# EAGLE schematic Layout (EAGLE 6.2)
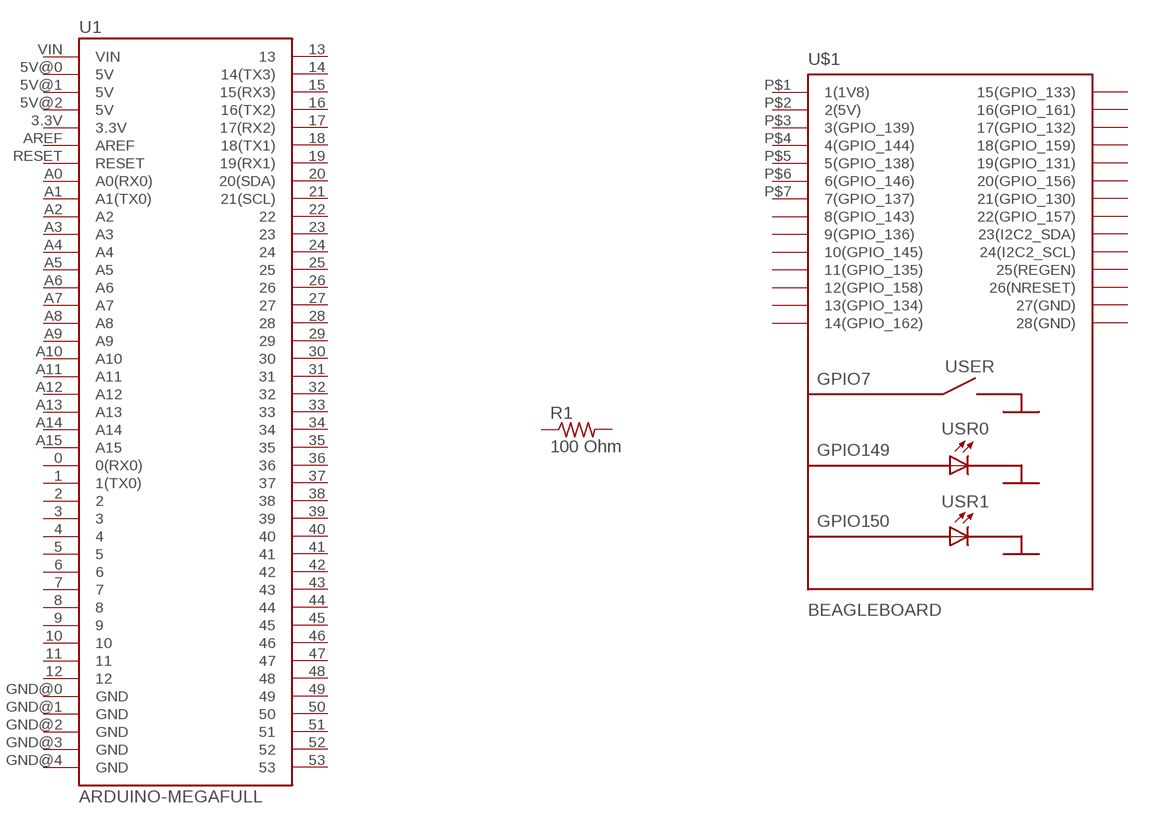
[diagram p0: schematic, sheet 1]

## Parts
R1  100 Ohm  R-US_0204/2V  [0204V]
U1  ARDUINO-MEGAFULL  [ARDUINO_MEGA]
U$1  BEAGLEBOARD  [BEAGLEBOARD]
Unconnected: R1.1 R1.2 U1.0(0(RX0)) U1.1(1(TX0)) U1.2 U1.3 U1.3.3V U1.4 U1.5 U1.5V@0(5V) U1.5V@1(5V) U1.5V@2(5V) U1.6 U1.7 U1.8 U1.9 U1.10 U1.11 U1.12 U1.13 U1.14(14(TX3)) U1.15(15(RX3)) U1.16(16(TX2)) U1.17(17(RX2)) U1.18(18(TX1)) U1.19(19(RX1)) U1.20(20(SDA)) U1.21(21(SCL)) U1.22 U1.23 U1.24 U1.25 U1.26 U1.27 U1.28 U1.29 U1.30 U1.31 U1.32 U1.33 U1.34 U1.35 U1.36 U1.37 U1.38 U1.39 U1.40 U1.41 U1.42 U1.43 U1.44 U1.45 U1.46 U1.47 U1.48 U1.49 U1.50 U1.51 U1.52 U1.53 U1.A0(A0(RX0)) U1.A1(A1(TX0)) U1.A2 U1.A3 U1.A4 U1.A5 U1.A6 U1.A7 U1.A8 U1.A9 U1.A10 U1.A11 U1.A12 U1.A13 U1.A14 U1.A15 U1.AREF U1.GND@0(GND) U1.GND@1(GND) U1.GND@2(GND) U1.GND@3(GND) U1.GND@4(GND) U1.RESET U1.VIN U$1.P$1(1(1V8)) U$1.P$2(2(5V)) U$1.P$3(3(GPIO_139)) U$1.P$4(4(GPIO_144)) U$1.P$5(5(GPIO_138)) U$1.P$6(6(GPIO_146)) U$1.P$7(7(GPIO_137)) U$1.P$8(8(GPIO_143)) U$1.P$9(9(GPIO_136)) U$1.P$10(10(GPIO_145)) U$1.P$11(11(GPIO_135)) U$1.P$12(12(GPIO_158)) U$1.P$13(13(GPIO_134)) U$1.P$14(14(GPIO_162)) U$1.P$15(15(GPIO_133)) U$1.P$16(16(GPIO_161)) U$1.P$17(17(GPIO_132)) U$1.P$18(18(GPIO_159)) U$1.P$19(19(GPIO_131)) U$1.P$20(20(GPIO_156)) U$1.P$21(21(GPIO_130)) U$1.P$22(22(GPIO_157)) U$1.P$23(23(I2C2_SDA)) U$1.P$24(24(I2C2_SCL)) U$1.P$25(25(REGEN)) U$1.P$26(26(NRESET)) U$1.P$27(27(GND)) U$1.P$28(28(GND))

## Library data of the parts
R1 = rcl:R-US_: RESISTOR, American symbol
U1 = SparkFun-Boards:ARDUINO-MEGA: Arduino Mega board footprint
U$1 = mecanum-symbols:BEAGLEBOARD